# Altium schematic sheet Miscellaneous_Functions.SchDoc: Miscellaneous Functions & Programming
size B; CheckedBy: Jason Sullins; Author: Jordan Harris-Toovy; Revision: 0.2; SheetNumber: 22; SheetTotal: 22; Size: ANSI B
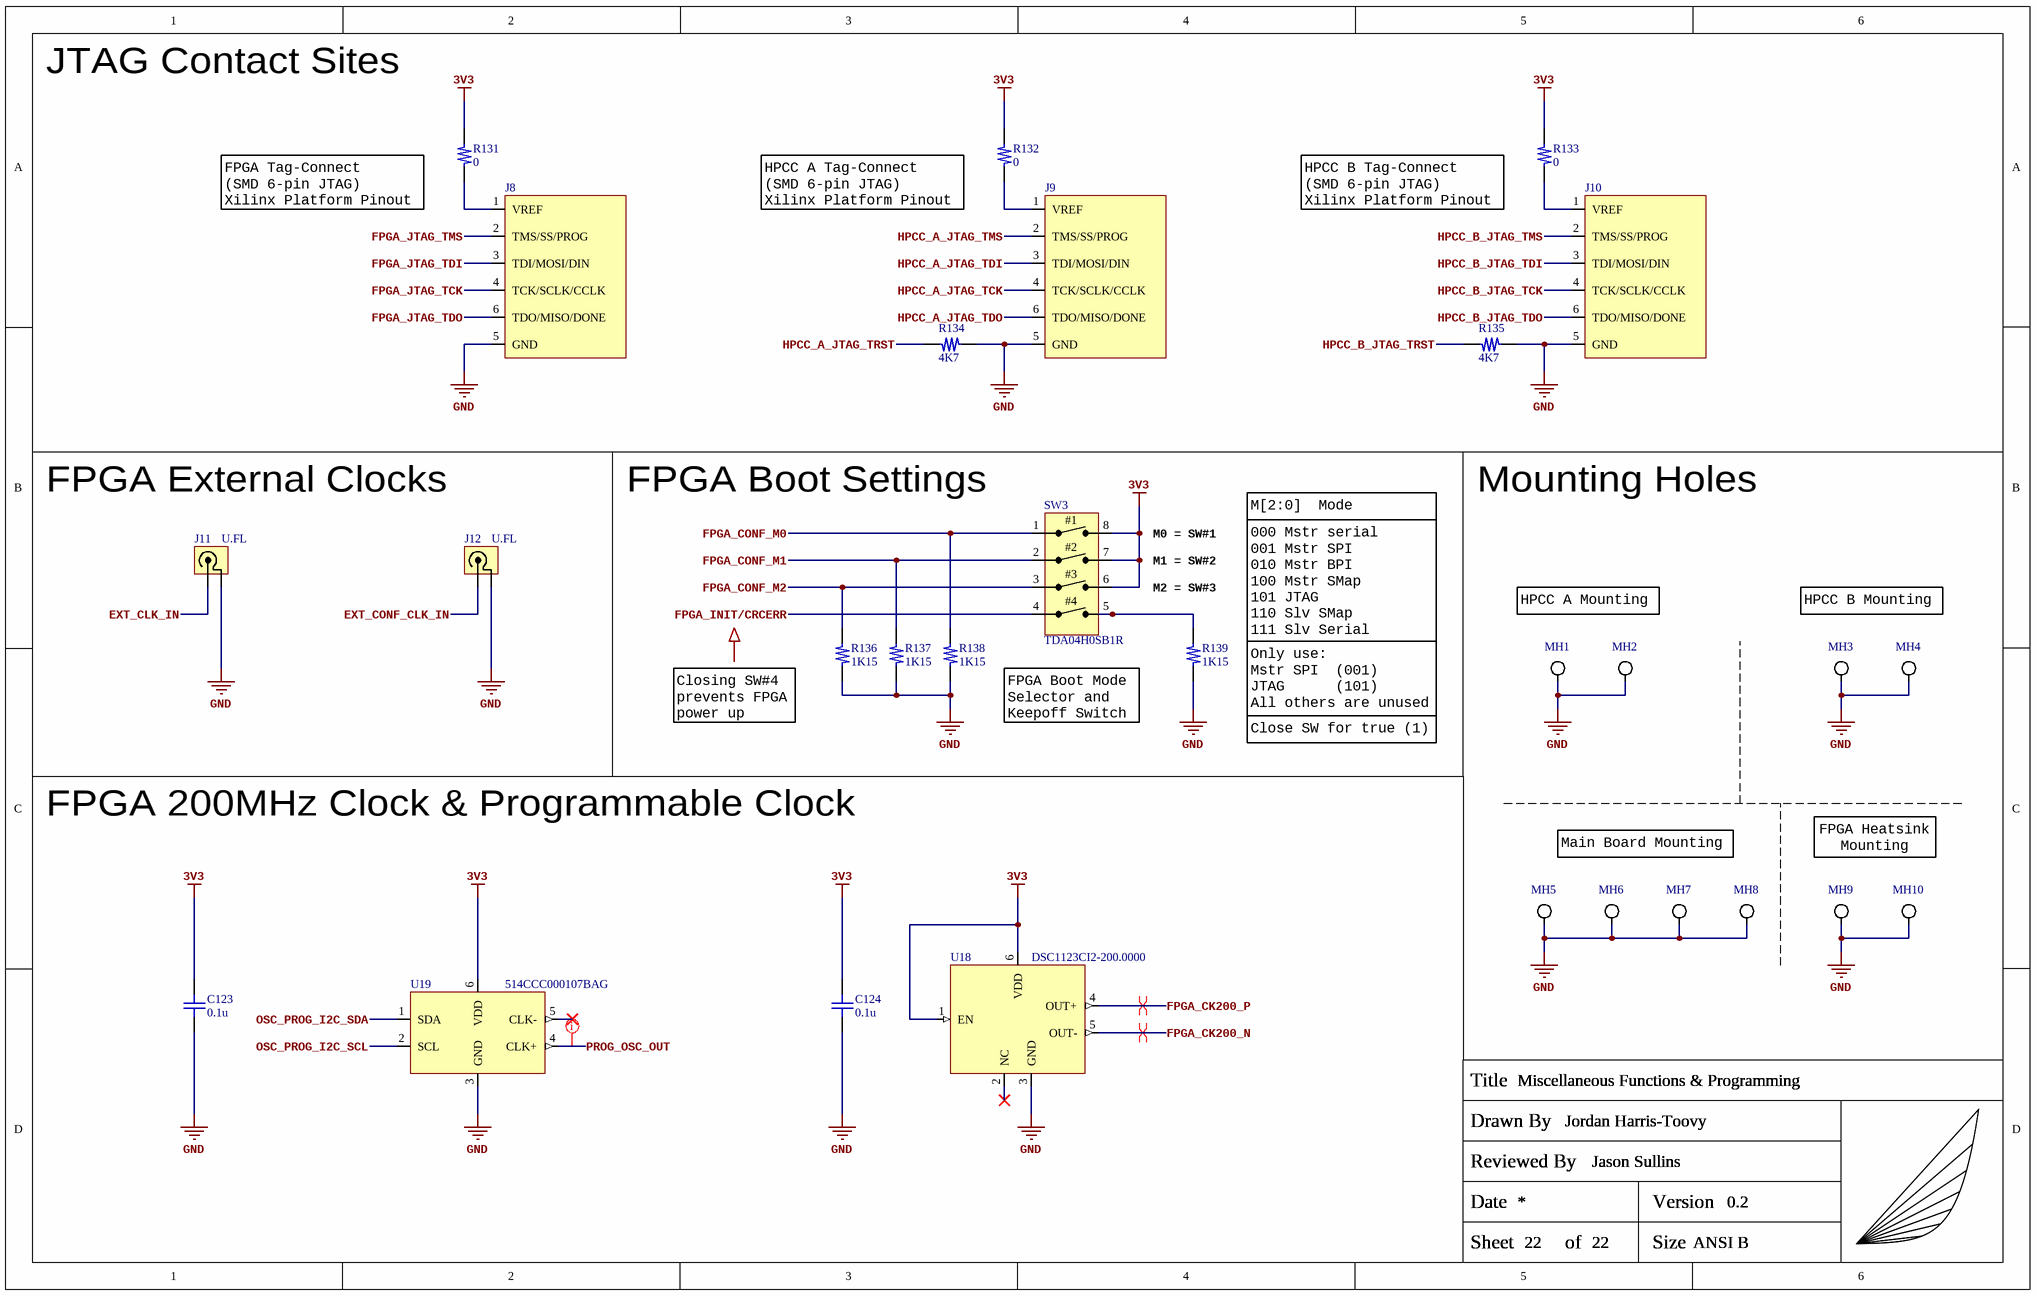
[diagram p0: Miscellaneous_Functions.SchDoc]

## Parts
C123  0.1u  [C_0402_Generic]
C124  0.1u  [C_0402_Generic]
J8  TC-XILINX6_6PIN  [TAG-CONNECT_NO-LEGS_6PIN]  (value not drawn)
J9  TC-XILINX6_6PIN  [TAG-CONNECT_NO-LEGS_6PIN]  (value not drawn)
J10  TC-XILINX6_6PIN  [TAG-CONNECT_NO-LEGS_6PIN]  (value not drawn)
J11  U.FL  [TE_IPEX]
J12  U.FL  [TE_IPEX]
MH1  M2.5 Mounting Hole  [M2.5_MOUNTING_HOLE]  (value not drawn)
MH2  M2.5 Mounting Hole  [M2.5_MOUNTING_HOLE]  (value not drawn)
MH3  M2.5 Mounting Hole  [M2.5_MOUNTING_HOLE]  (value not drawn)
MH4  M2.5 Mounting Hole  [M2.5_MOUNTING_HOLE]  (value not drawn)
MH5  M2.5 Mounting Hole  [M2.5_MOUNTING_HOLE]  (value not drawn)
MH6  M2.5 Mounting Hole  [M2.5_MOUNTING_HOLE]  (value not drawn)
MH7  M2.5 Mounting Hole  [M2.5_MOUNTING_HOLE]  (value not drawn)
MH8  M2.5 Mounting Hole  [M2.5_MOUNTING_HOLE]  (value not drawn)
MH9  M2.5 Mounting Hole  [M2.5_MOUNTING_HOLE]  (value not drawn)
MH10  M2.5 Mounting Hole  [M2.5_MOUNTING_HOLE]  (value not drawn)
R131  0  [R_0402_Generic]
R132  0  [R_0402_Generic]
R133  0  [R_0402_Generic]
R134  4K7  [R_0402_Generic]
R135  4K7  [R_0402_Generic]
R136  1K15  [R_0402_Generic]
R137  1K15  [R_0402_Generic]
R138  1K15  [R_0402_Generic]
R139  1K15  [R_0402_Generic]
SW3  TDA04H0SB1R  [C&K_TDA_GULL_04POS]
TITLEBLOCK?  Capstone_Title_Block  (value not drawn)  (graphical)
U18  DSC1123CI2-200.0000  [Microchip_DSC1123CI2]
U19  514CCC000107BAG  [Si514_Size-B]

## Nets
3V3: C123.2 C124.2 R131.2 R132.2 R133.2 SW3.6(2C) SW3.7(2B) SW3.8(2A) U18.1(EN) U18.6(VDD) U19.6(VDD)
GND: C123.1 C124.1 J8.5(GND) J9.5(GND) J10.5(GND) J11.2(GND) J12.2(GND) MH1.0 MH2.0 MH3.0 MH4.0 MH5.0 MH6.0 MH7.0 MH8.0 MH9.0 MH10.0 R134.1 R135.1 R136.1 R137.1 R138.1 R139.1 U18.3(GND) U19.3(GND)
EXT_CLK_IN: J11.1(RF)
EXT_CONF_CLK_IN: J12.1(RF)
FPGA_CK200_N: U18.5(OUT-)
FPGA_CK200_P: U18.4(OUT+)
FPGA_CONF_M0: R138.2 SW3.1(1A)
FPGA_CONF_M1: R137.2 SW3.2(1B)
FPGA_CONF_M2: R136.2 SW3.3(1C)
FPGA_INIT/CRCERR: SW3.4(1D)
FPGA_JTAG_TCK: J8.4(TCK/SCLK/CCLK)
FPGA_JTAG_TDI: J8.3(TDI/MOSI/DIN)
FPGA_JTAG_TDO: J8.6(TDO/MISO/DONE)
FPGA_JTAG_TMS: J8.2(TMS/SS/PROG)
HPCC_A_JTAG_TCK: J9.4(TCK/SCLK/CCLK)
HPCC_A_JTAG_TDI: J9.3(TDI/MOSI/DIN)
HPCC_A_JTAG_TDO: J9.6(TDO/MISO/DONE)
HPCC_A_JTAG_TMS: J9.2(TMS/SS/PROG)
HPCC_A_JTAG_TRST: R134.2
HPCC_B_JTAG_TCK: J10.4(TCK/SCLK/CCLK)
HPCC_B_JTAG_TDI: J10.3(TDI/MOSI/DIN)
HPCC_B_JTAG_TDO: J10.6(TDO/MISO/DONE)
HPCC_B_JTAG_TMS: J10.2(TMS/SS/PROG)
HPCC_B_JTAG_TRST: R135.2
OSC_PROG_I2C_SCL: U19.2(SCL)
OSC_PROG_I2C_SDA: U19.1(SDA)
PROG_OSC_OUT: U19.4(CLK+)
NetJ8_1: J8.1(VREF) R131.1
NetJ9_1: J9.1(VREF) R132.1
NetJ10_1: J10.1(VREF) R133.1
NetR139_2: R139.2 SW3.5(2D)

Not connected (* = marked no-connect by the designer): U18 2(NC)*; U19 5(CLK-)*

## Layout directives
net class SE50_GENERAL: PROG_OSC_OUT
differential pair; differential pair class DP100_GENERAL: FPGA_CK200_N, FPGA_CK200_P

## Notes on the sheet
- JTAG Contact Sites
- (near R131) FPGA Tag-Connect
  (SMD 6-pin JTAG)
  Xilinx Platform Pinout
- (near R132) HPCC A Tag-Connect
  (SMD 6-pin JTAG)
  Xilinx Platform Pinout
- (near R133) HPCC B Tag-Connect
  (SMD 6-pin JTAG)
  Xilinx Platform Pinout
- FPGA External Clocks
- FPGA Boot Settings
- Mounting Holes
- M1 = SW#2
- M0 = SW#1
- M[2:0]  Mode
- M2 = SW#3
- 000	Mstr serial
  001	Mstr SPI
  010	Mstr BPI
  100	Mstr SMap
  101	JTAG
  110	Slv SMap
  111	Slv Serial
- HPCC A Mounting
- HPCC B Mounting
- (near R136) Closing SW#4 prevents FPGA power up
- FPGA Boot Mode Selector and Keepoff Switch
- Only use:
  Mstr SPI  (001)
  JTAG      (101)
  All others are unused
- Close SW for true (1)
- FPGA 200MHz Clock & Programmable Clock
- Main Board Mounting
- FPGA Heatsink Mounting
- (in symbol Capstone_Title_Block) Title; Drawn By; Reviewed By; Date; Version; Sheet; of; Size
- (in symbol TDA04H0SB1R) #1; #2; #3; #4

## Library data of the parts
C123 C124 = GRM155R71C104KA88D: 0.1µF 16V X7R SMD ceramic capacitor in 0402 size; Manufacturer: Murata Electronics; Manufacturer Part Number: GRM155R71C104KA88D
J8-J10 = TC-XILINX6_6PIN: 6-pin (legless) Xilinx JTAG Tag-Connect site; Manufacturer: NONE; Manufacturer2 Part Number: TC2030-IDC-NL; Manufacturer Part Number: NONE; Manufacturer2: Tag-Connect
J11 J12 = CONUFL001-SMD-T: U.FL (UMCC) Connector, SMD, 50Ohm; Manufacturer: TE Connectivity; Manufacturer Part Number: CONUFL001-SMD-T
MH1-MH10 = M2.5 Mounting Hole: M.2 Mounting hole; Manufacturer: NONE; Manufacturer Part Number: NONE
R131-R133 = ERJ-2GE0R00X: Jumper 0Ohm SMD resistor in 0402 size; Manufacturer: Panasonic; Manufacturer Part Number: ERJ-2GE0R00X
R134 R135 = ERJ-2RKF4701X: 4.7KOhm 1% 1/10W SMD resistor in 0402 size; Manufacturer: Panasonic; Manufacturer Part Number: ERJ-2RKF4701X
R136-R139 = ERJ-2RKF1151X: 1.15KOhm 1% 1/10W SMD resistor in 0402 size; Manufacturer: Panasonic; Manufacturer Part Number: ERJ-2RKF1151X
SW3 = TDA04H0SB1R: Dip Switch SPST 4 Position 25mA 24VDC; Manufacturer: C&K; Manufacturer Part Number: TDA04H0SB1R
TITLEBLOCK? = Capstone_Title_Block: Custom title block with personal logo; Manufacturer: NONE; Manufacturer Part Number: NONE
U18 = DSC1123CI2-200.0000: MEMS OSC XO 200.0000MHZ LVDS SMD; Manufacturer: Microchip Technology; Manufacturer Part Number: DSC1123CI2-200.0000
U19 = 514CCC000107BAG: I2C Programmable oscillator differential/single-ended 0.1-125 MHz; Manufacturer: Skyworks Solutions; Manufacturer Part Number: 514CCC000107BAG